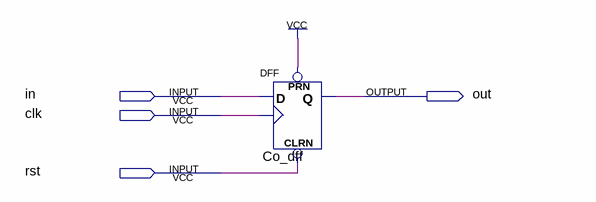
[diagram p0: schematic sheet]
// Quartus schematic ffd.bdf as structural Verilog: 1 symbols, 4 pins
module ffd (
  input  in,
  input  clk,
  input  rst,
  output out
);

  DFF Co_dff (.CLRN(rst), .CLK(clk), .D(in), .PRN(1'b1), .Q(out));
endmodule
